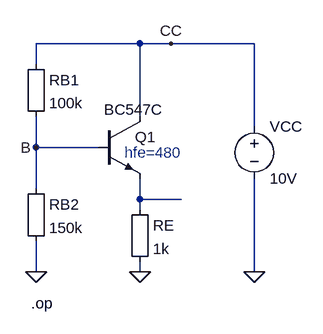
[diagram p0: schematic CC-1.asc]
CC-1.asc, the LTspice schematic file:
Version 4
SHEET 1 880 680
WIRE 256 16 96 16
WIRE 304 16 256 16
WIRE 432 16 304 16
WIRE 96 48 96 16
WIRE 256 128 256 16
WIRE 432 144 432 16
WIRE 96 176 96 128
WIRE 192 176 96 176
WIRE 96 240 96 176
WIRE 256 256 256 224
WIRE 320 256 256 256
WIRE 256 272 256 256
WIRE 96 368 96 320
WIRE 256 368 256 352
WIRE 432 368 432 224
FLAG 432 368 0
FLAG 96 176 B
FLAG 304 16 CC
FLAG 256 368 0
FLAG 96 368 0
DATAFLAG 144 176 "round($*1000)/1000"
DATAFLAG 304 256 "round($*1k)/1k"
SYMBOL npn 192 128 R0
WINDOW 3 9 -10 Left 2
SYMATTR InstName Q1
SYMATTR Value BC547C
SYMBOL Misc\\EuropeanResistor 240 256 R0
SYMATTR InstName RE
SYMATTR Value 1k
SYMBOL Misc\\EuropeanResistor 80 32 R0
SYMATTR InstName RB1
SYMATTR Value 100k
SYMBOL voltage 432 128 R0
WINDOW 123 0 0 Left 0
WINDOW 39 0 0 Left 0
SYMATTR InstName VCC
SYMATTR Value 10V
SYMBOL Misc\\EuropeanResistor 80 224 R0
SYMATTR InstName RB2
SYMATTR Value 150k
TEXT 88 416 Left 2 !.op
TEXT 232 184 Left 2 ;hfe=480

The netlist it stands for:
* CC-1.asc
Q1 CC B N001 0 BC547C
RE N001 0 1k
RB1 CC B 100k
VCC CC 0 10V
RB2 B 0 150k
.model NPN NPN
.model PNP PNP
.lib standard.bjt
.op
* hfe=480
.backanno
.end